# EAGLE design Single Board 12s (EAGLE 9.6.2)
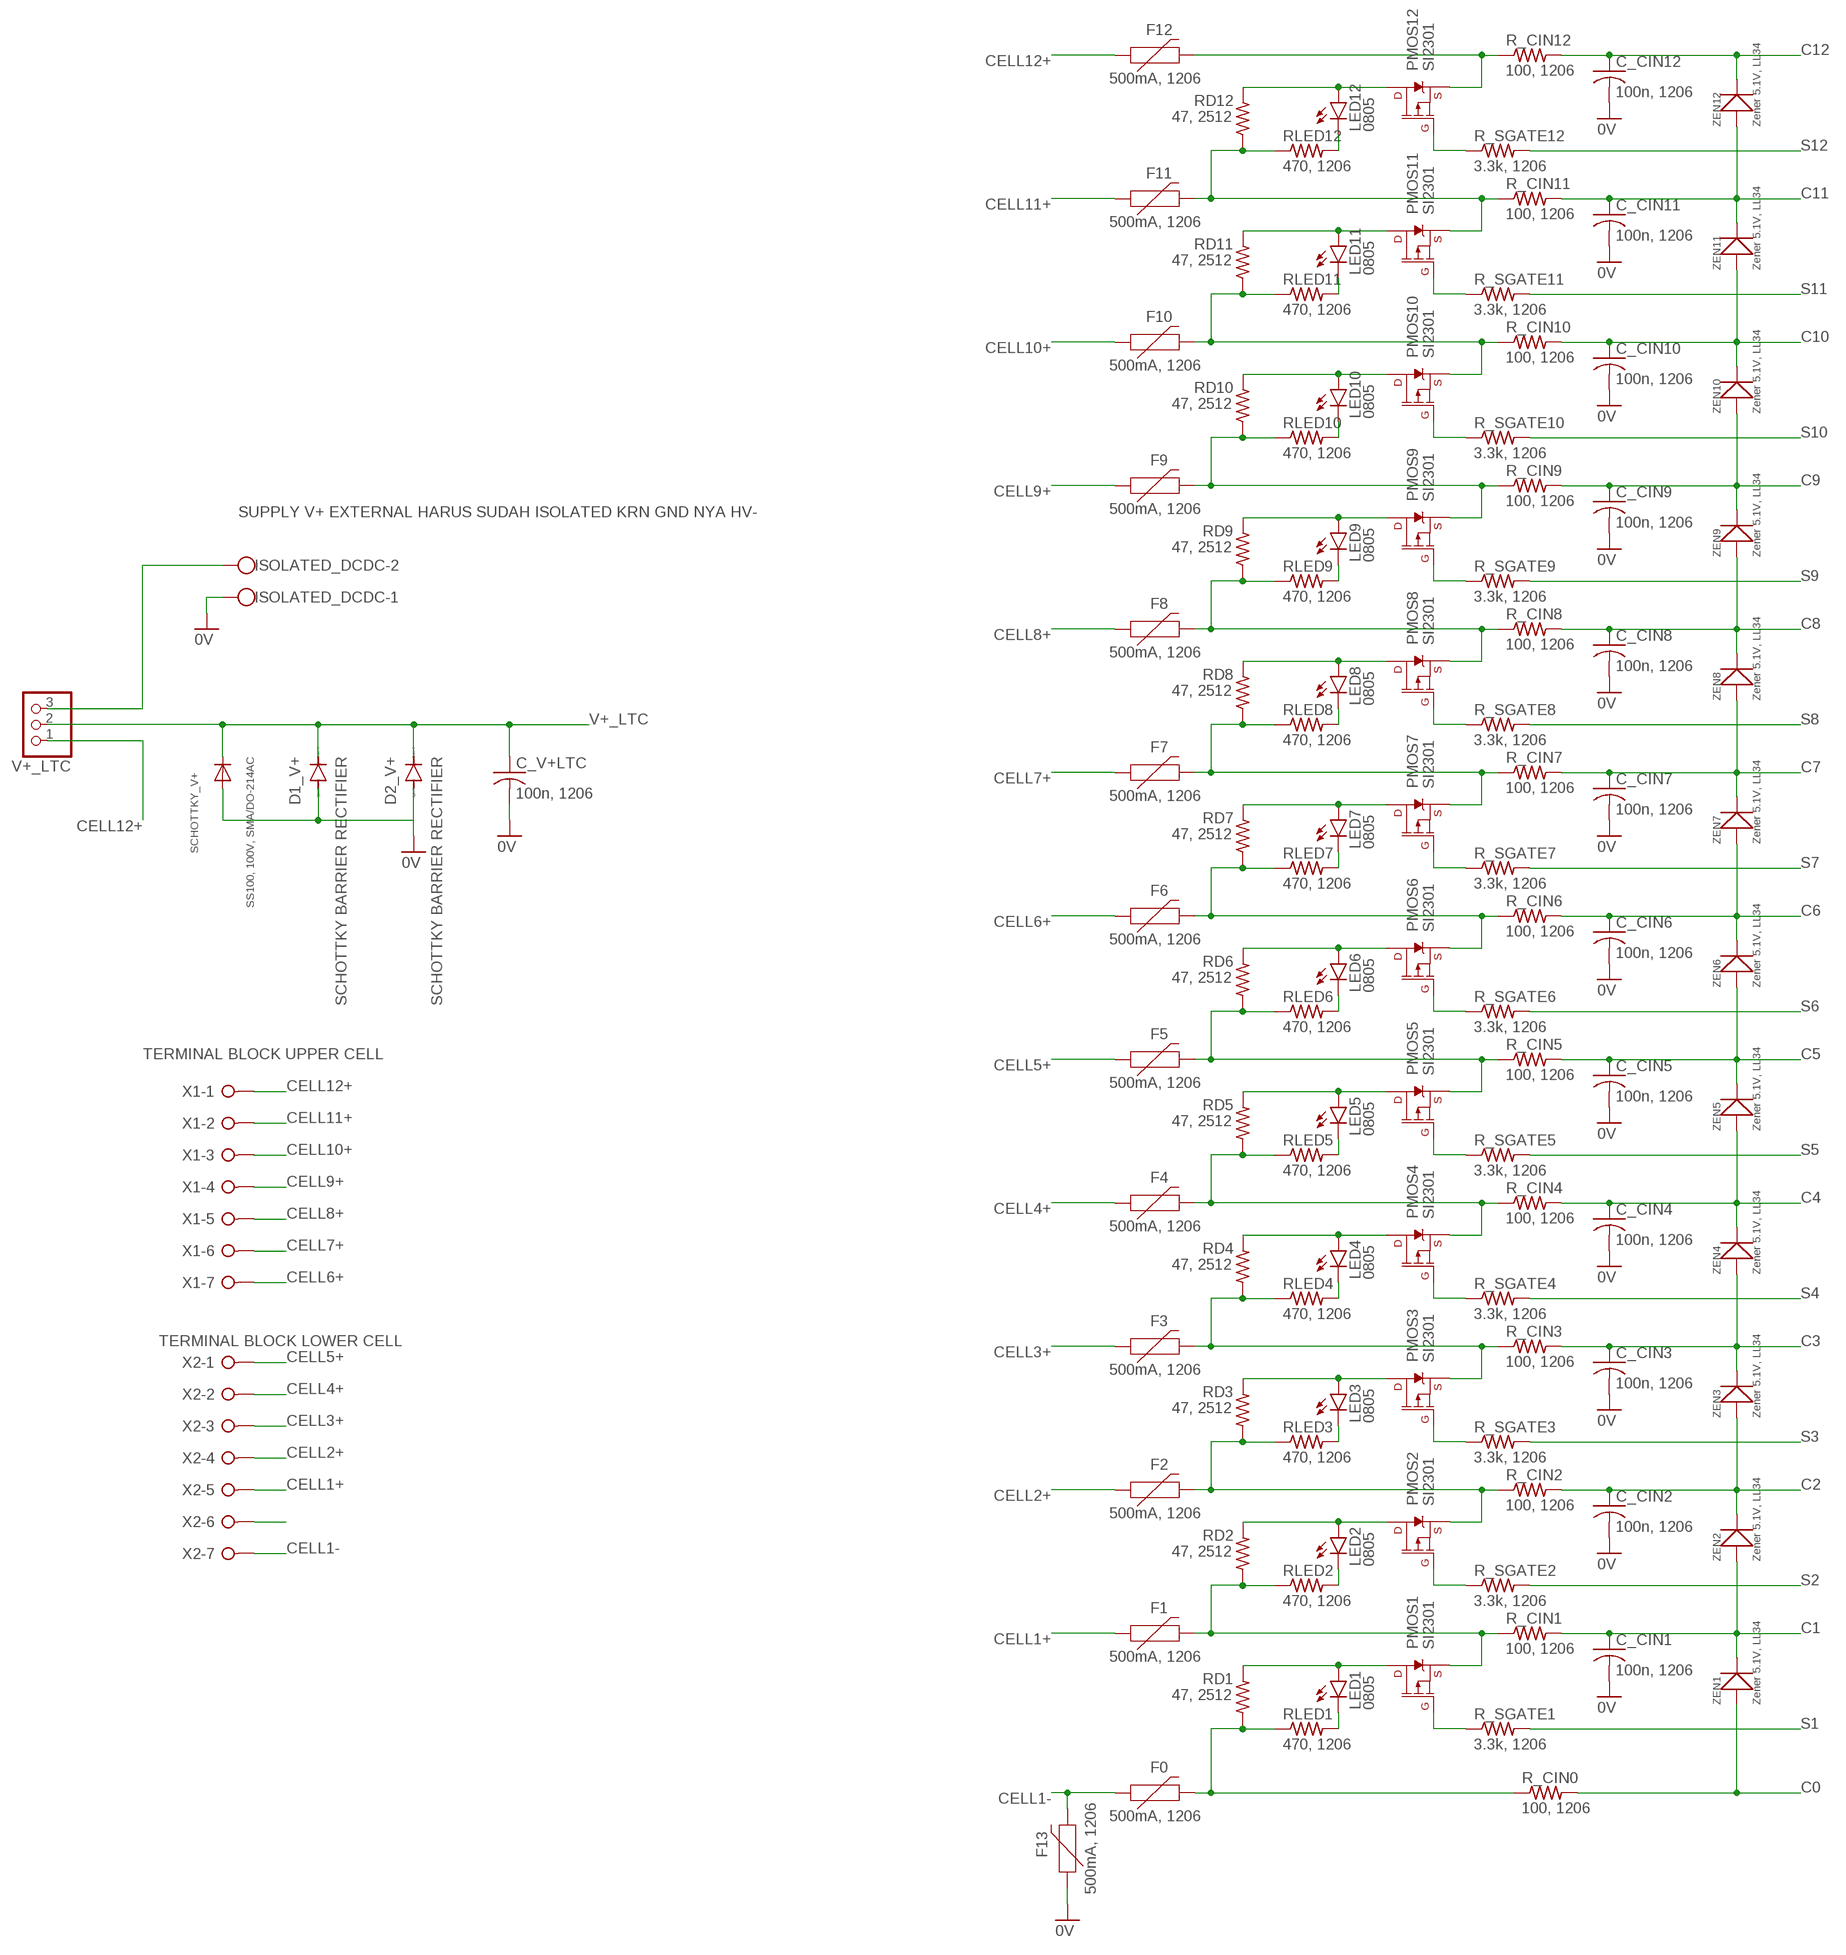
[diagram p0: schematic, sheet 1, part 1 of 2]
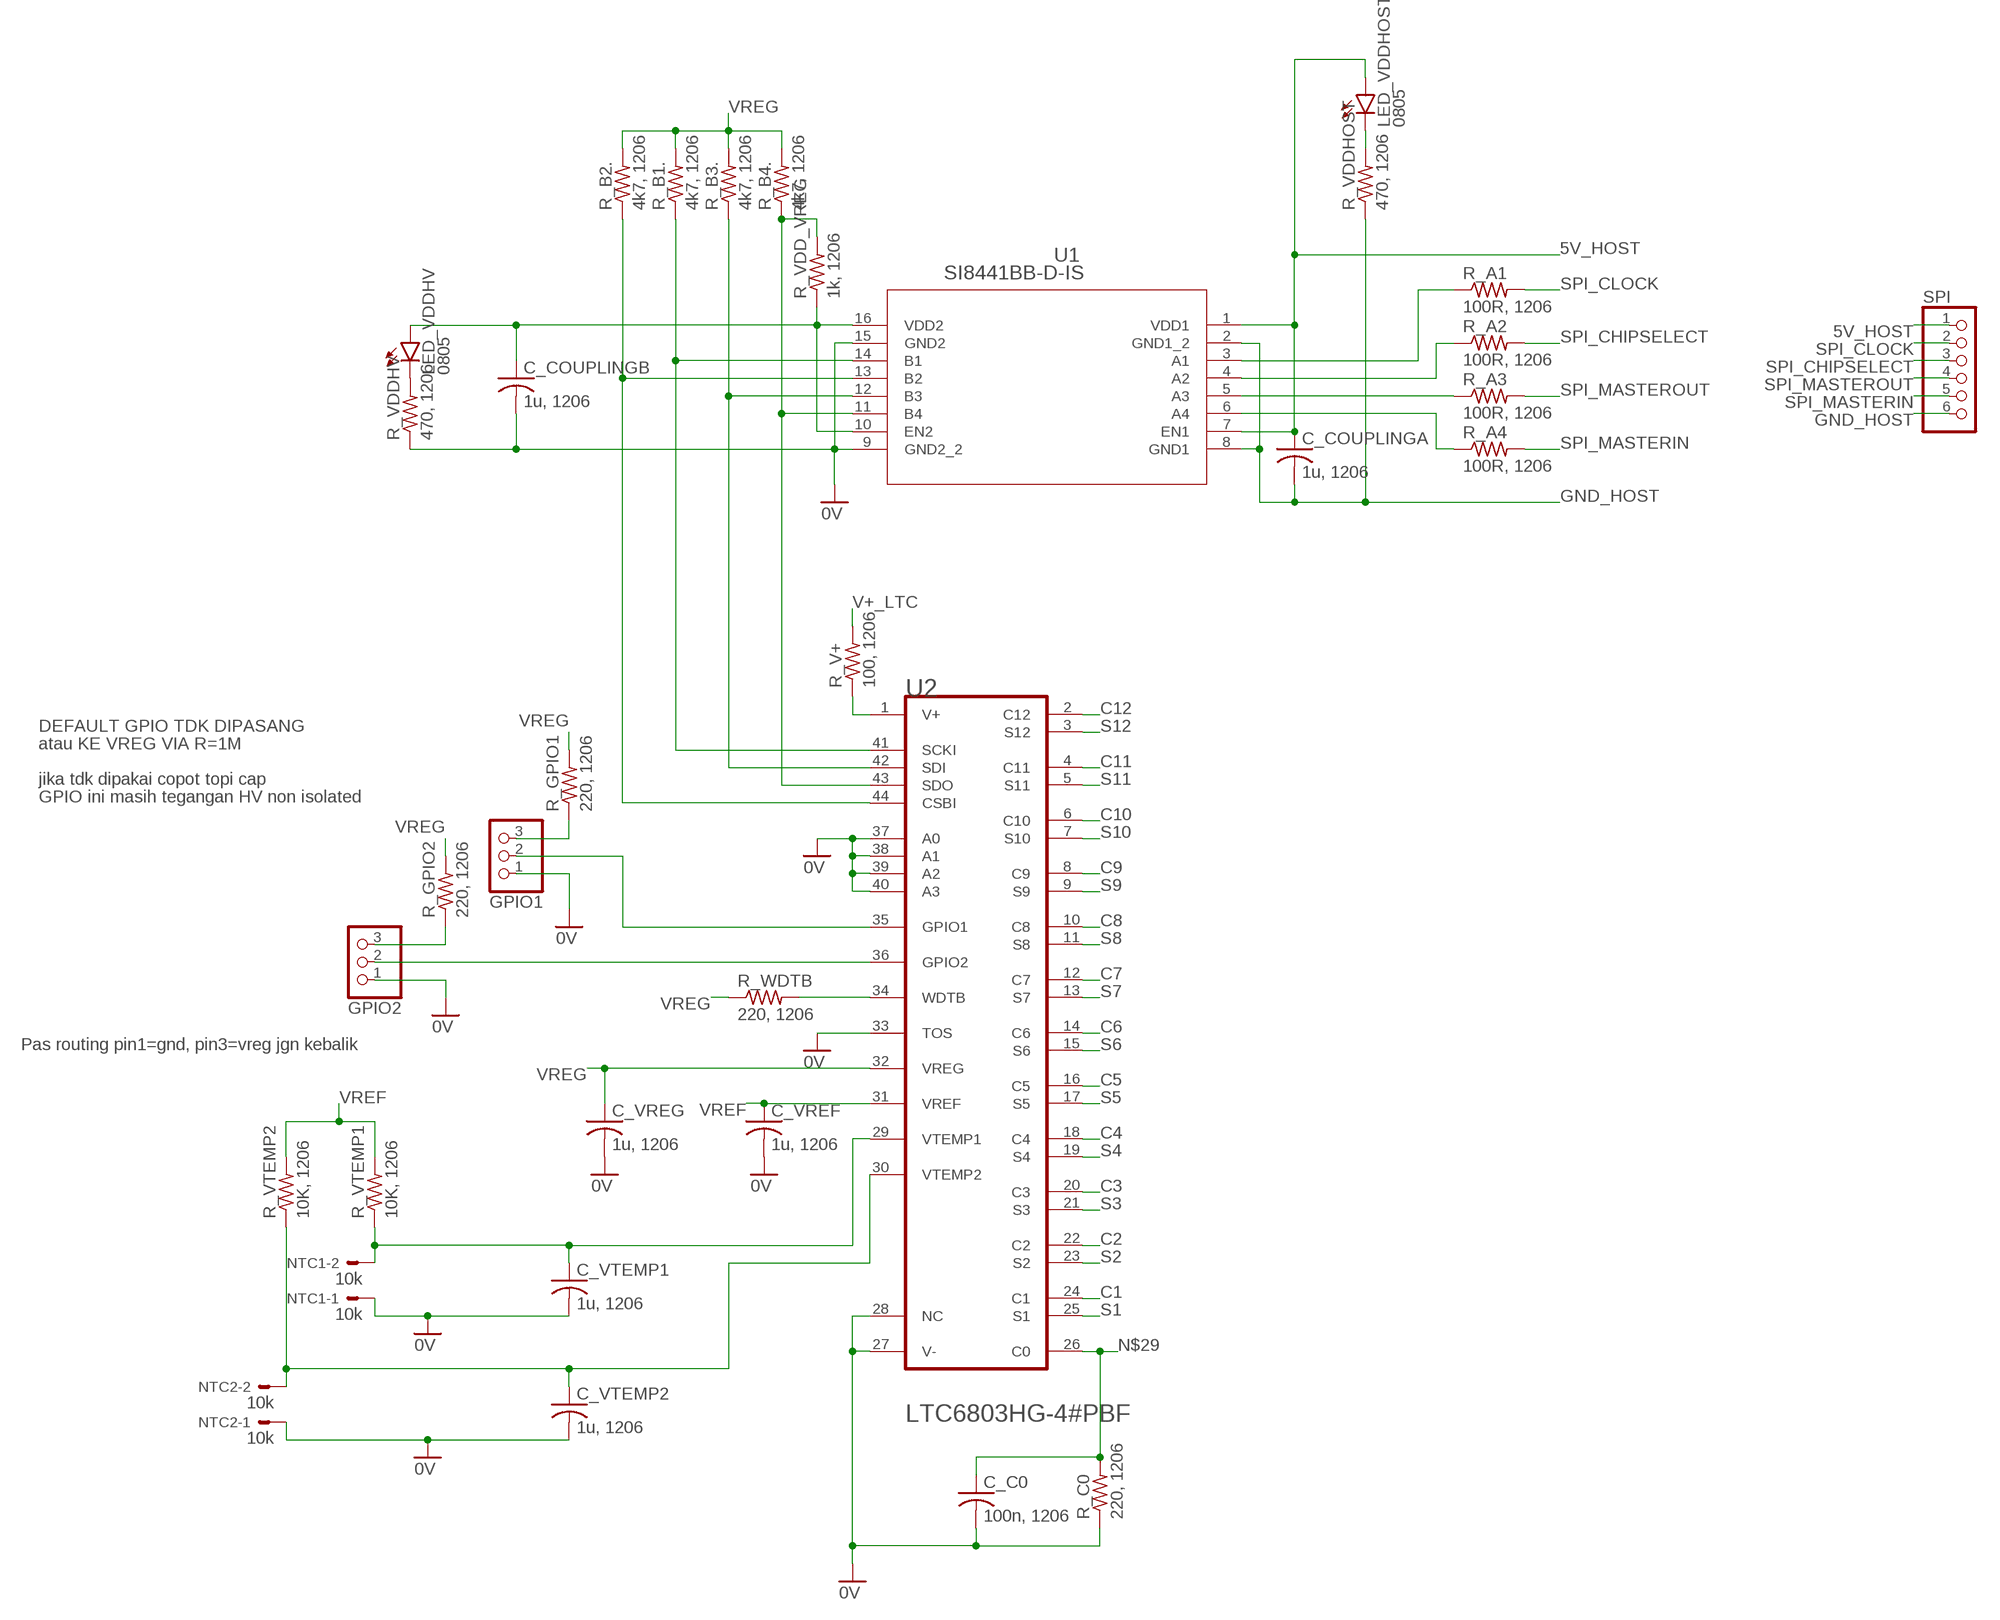
[diagram p1: schematic, sheet 1, part 2 of 2]

## Parts
C_C0  100n, 1206  C-USC1206  [C1206]
C_CIN1  100n, 1206  C-USC1206  [C1206]
C_CIN2  100n, 1206  C-USC1206  [C1206]
C_CIN3  100n, 1206  C-USC1206  [C1206]
C_CIN4  100n, 1206  C-USC1206  [C1206]
C_CIN5  100n, 1206  C-USC1206  [C1206]
C_CIN6  100n, 1206  C-USC1206  [C1206]
C_CIN7  100n, 1206  C-USC1206  [C1206]
C_CIN8  100n, 1206  C-USC1206  [C1206]
C_CIN9  100n, 1206  C-USC1206  [C1206]
C_CIN10  100n, 1206  C-USC1206  [C1206]
C_CIN11  100n, 1206  C-USC1206  [C1206]
C_CIN12  100n, 1206  C-USC1206  [C1206]
C_COUPLINGA  1u, 1206  C-USC1206  [C1206]
C_COUPLINGB  1u, 1206  C-USC1206  [C1206]
C_V+LTC  100n, 1206  C-USC1206  [C1206]
C_VREF  1u, 1206  C-USC1206  [C1206]
C_VREG  1u, 1206  C-USC1206  [C1206]
C_VTEMP1  1u, 1206  C-USC1206  [C1206]
C_VTEMP2  1u, 1206  C-USC1206  [C1206]
D1_V+  SCHOTTKY BARRIER RECTIFIER  DIODE-DO27-15  [DO27-15]
D2_V+  SCHOTTKY BARRIER RECTIFIER  DIODE-DO27-15  [DO27-15]
F0  500mA, 1206  PPTC_6V500MA-2  [1206]
F1  500mA, 1206  PPTC_6V500MA-2  [1206]
F2  500mA, 1206  PPTC_6V500MA-2  [1206]
F3  500mA, 1206  PPTC_6V500MA-2  [1206]
F4  500mA, 1206  PPTC_6V500MA-2  [1206]
F5  500mA, 1206  PPTC_6V500MA-2  [1206]
F6  500mA, 1206  PPTC_6V500MA-2  [1206]
F7  500mA, 1206  PPTC_6V500MA-2  [1206]
F8  500mA, 1206  PPTC_6V500MA-2  [1206]
F9  500mA, 1206  PPTC_6V500MA-2  [1206]
F10  500mA, 1206  PPTC_6V500MA-2  [1206]
F11  500mA, 1206  PPTC_6V500MA-2  [1206]
F12  500mA, 1206  PPTC_6V500MA-2  [1206]
F13  500mA, 1206  PPTC_6V500MA-2  [1206]
GPIO1  PINHD-1X3  [1X03]
GPIO2  PINHD-1X3  [1X03]
ISOLATED_DCDC  W237-102  [W237-102]
LED1  0805  LEDSML0805  [SML0805]
LED2  0805  LEDSML0805  [SML0805]
LED3  0805  LEDSML0805  [SML0805]
LED4  0805  LEDSML0805  [SML0805]
LED5  0805  LEDSML0805  [SML0805]
LED6  0805  LEDSML0805  [SML0805]
LED7  0805  LEDSML0805  [SML0805]
LED8  0805  LEDSML0805  [SML0805]
LED9  0805  LEDSML0805  [SML0805]
LED10  0805  LEDSML0805  [SML0805]
LED11  0805  LEDSML0805  [SML0805]
LED12  0805  LEDSML0805  [SML0805]
LED_VDDHOST  0805  LEDSML0805  [SML0805]
LED_VDDHV  0805  LEDSML0805  [SML0805]
NTC1  10k  KK-156-2  [KK-156-2]
NTC2  10k  KK-156-2  [KK-156-2]
PMOS1  SI2301  MOSFET_PCH-SI2309DS  [SOT23-3]
PMOS2  SI2301  MOSFET_PCH-SI2309DS  [SOT23-3]
PMOS3  SI2301  MOSFET_PCH-SI2309DS  [SOT23-3]
PMOS4  SI2301  MOSFET_PCH-SI2309DS  [SOT23-3]
PMOS5  SI2301  MOSFET_PCH-SI2309DS  [SOT23-3]
PMOS6  SI2301  MOSFET_PCH-SI2309DS  [SOT23-3]
PMOS7  SI2301  MOSFET_PCH-SI2309DS  [SOT23-3]
PMOS8  SI2301  MOSFET_PCH-SI2309DS  [SOT23-3]
PMOS9  SI2301  MOSFET_PCH-SI2309DS  [SOT23-3]
PMOS10  SI2301  MOSFET_PCH-SI2309DS  [SOT23-3]
PMOS11  SI2301  MOSFET_PCH-SI2309DS  [SOT23-3]
PMOS12  SI2301  MOSFET_PCH-SI2309DS  [SOT23-3]
R_A1  100R, 1206  R-US_R1206  [R1206]
R_A2  100R, 1206  R-US_R1206  [R1206]
R_A3  100R, 1206  R-US_R1206  [R1206]
R_A4  100R, 1206  R-US_R1206  [R1206]
R_B1.  4k7, 1206  R-US_R1206  [R1206]
R_B2.  4k7, 1206  R-US_R1206  [R1206]
R_B3.  4k7, 1206  R-US_R1206  [R1206]
R_B4.  4k7, 1206  R-US_R1206  [R1206]
R_C0  220, 1206  R-US_R1206  [R1206]
R_CIN0  100, 1206  R-US_R1206  [R1206]
R_CIN1  100, 1206  R-US_R1206  [R1206]
R_CIN2  100, 1206  R-US_R1206  [R1206]
R_CIN3  100, 1206  R-US_R1206  [R1206]
R_CIN4  100, 1206  R-US_R1206  [R1206]
R_CIN5  100, 1206  R-US_R1206  [R1206]
R_CIN6  100, 1206  R-US_R1206  [R1206]
R_CIN7  100, 1206  R-US_R1206  [R1206]
R_CIN8  100, 1206  R-US_R1206  [R1206]
R_CIN9  100, 1206  R-US_R1206  [R1206]
R_CIN10  100, 1206  R-US_R1206  [R1206]
R_CIN11  100, 1206  R-US_R1206  [R1206]
R_CIN12  100, 1206  R-US_R1206  [R1206]
R_GPIO1  220, 1206  R-US_R1206  [R1206]
R_GPIO2  220, 1206  R-US_R1206  [R1206]
R_SGATE1  3.3k, 1206  R-US_R1206  [R1206]
R_SGATE2  3.3k, 1206  R-US_R1206  [R1206]
R_SGATE3  3.3k, 1206  R-US_R1206  [R1206]
R_SGATE4  3.3k, 1206  R-US_R1206  [R1206]
R_SGATE5  3.3k, 1206  R-US_R1206  [R1206]
R_SGATE6  3.3k, 1206  R-US_R1206  [R1206]
R_SGATE7  3.3k, 1206  R-US_R1206  [R1206]
R_SGATE8  3.3k, 1206  R-US_R1206  [R1206]
R_SGATE9  3.3k, 1206  R-US_R1206  [R1206]
R_SGATE10  3.3k, 1206  R-US_R1206  [R1206]
R_SGATE11  3.3k, 1206  R-US_R1206  [R1206]
R_SGATE12  3.3k, 1206  R-US_R1206  [R1206]
R_V+  100, 1206  R-US_R1206  [R1206]
R_VDD_VREG  1k, 1206  R-US_R1206  [R1206]
R_VDDHOST  470, 1206  R-US_R1206  [R1206]
R_VDDHV  470, 1206  R-US_R1206  [R1206]
R_VTEMP1  10K, 1206  R-US_R1206  [R1206]
R_VTEMP2  10K, 1206  R-US_R1206  [R1206]
R_WDTB  220, 1206  R-US_R1206  [R1206]
RD1  47, 2512  R-US_R2512  [R2512]
RD2  47, 2512  R-US_R2512  [R2512]
RD3  47, 2512  R-US_R2512  [R2512]
RD4  47, 2512  R-US_R2512  [R2512]
RD5  47, 2512  R-US_R2512  [R2512]
RD6  47, 2512  R-US_R2512  [R2512]
RD7  47, 2512  R-US_R2512  [R2512]
RD8  47, 2512  R-US_R2512  [R2512]
RD9  47, 2512  R-US_R2512  [R2512]
RD10  47, 2512  R-US_R2512  [R2512]
RD11  47, 2512  R-US_R2512  [R2512]
RD12  47, 2512  R-US_R2512  [R2512]
RLED1  470, 1206  R-US_R1206  [R1206]
RLED2  470, 1206  R-US_R1206  [R1206]
RLED3  470, 1206  R-US_R1206  [R1206]
RLED4  470, 1206  R-US_R1206  [R1206]
RLED5  470, 1206  R-US_R1206  [R1206]
RLED6  470, 1206  R-US_R1206  [R1206]
RLED7  470, 1206  R-US_R1206  [R1206]
RLED8  470, 1206  R-US_R1206  [R1206]
RLED9  470, 1206  R-US_R1206  [R1206]
RLED10  470, 1206  R-US_R1206  [R1206]
RLED11  470, 1206  R-US_R1206  [R1206]
RLED12  470, 1206  R-US_R1206  [R1206]
SCHOTTKY_V+  SS100, 100V, SMA/DO-214AC  DIODESMA  [SMADIODE]
SPI  PINHD-1X6  [1X06]
U1  SI8441BB-D-IS  [SOIC-16W_SIL]
U2  LINEAR_TECHNOLOGY_LTC6803HG-4#PBFLINEAR_TECHNOLOGY_LTC6803HG-4#PBF_0_2  [LINEAR_TECHNOLOGY_LTC6803HG-4#PBF_2]
V+_LTC  PINHD-1X3  [1X03]
X1  W237-07P  [W237-7P]
X2  W237-07P  [W237-7P]
ZEN1  Zener 5.1V, LL34  SMD-DIODE-SWITCHING-75V-200MA(LL-34)  [LL-34]
ZEN2  Zener 5.1V, LL34  SMD-DIODE-SWITCHING-75V-200MA(LL-34)  [LL-34]
ZEN3  Zener 5.1V, LL34  SMD-DIODE-SWITCHING-75V-200MA(LL-34)  [LL-34]
ZEN4  Zener 5.1V, LL34  SMD-DIODE-SWITCHING-75V-200MA(LL-34)  [LL-34]
ZEN5  Zener 5.1V, LL34  SMD-DIODE-SWITCHING-75V-200MA(LL-34)  [LL-34]
ZEN6  Zener 5.1V, LL34  SMD-DIODE-SWITCHING-75V-200MA(LL-34)  [LL-34]
ZEN7  Zener 5.1V, LL34  SMD-DIODE-SWITCHING-75V-200MA(LL-34)  [LL-34]
ZEN8  Zener 5.1V, LL34  SMD-DIODE-SWITCHING-75V-200MA(LL-34)  [LL-34]
ZEN9  Zener 5.1V, LL34  SMD-DIODE-SWITCHING-75V-200MA(LL-34)  [LL-34]
ZEN10  Zener 5.1V, LL34  SMD-DIODE-SWITCHING-75V-200MA(LL-34)  [LL-34]
ZEN11  Zener 5.1V, LL34  SMD-DIODE-SWITCHING-75V-200MA(LL-34)  [LL-34]
ZEN12  Zener 5.1V, LL34  SMD-DIODE-SWITCHING-75V-200MA(LL-34)  [LL-34]

## Nets
0V: C_C0.2 C_CIN1.2 C_CIN2.2 C_CIN3.2 C_CIN4.2 C_CIN5.2 C_CIN6.2 C_CIN7.2 C_CIN8.2 C_CIN9.2 C_CIN10.2 C_CIN11.2 C_CIN12.2 C_COUPLINGB.2 C_V+LTC.2 C_VREF.2 C_VREG.2 C_VTEMP1.2 C_VTEMP2.2 D1_V+.A D2_V+.A F13.1 GPIO1.1 GPIO2.1 ISOLATED_DCDC.1 NTC1.1 NTC2.1 R_C0.1 R_VDDHV.1 SCHOTTKY_V+.A U1.9(GND2_2) U1.15(GND2) U2.27(V-) U2.28(NC) U2.33(TOS) U2.37(A0) U2.38(A1) U2.39(A2) U2.40(A3)
5V_HOST: C_COUPLINGA.1 LED_VDDHOST.A SPI.1 U1.1(VDD1) U1.7(EN1)
C0: R_CIN0.2 ZEN1.A(+)
C1: C_CIN1.1 R_CIN1.2 U2.24(C1) ZEN1.C(-) ZEN2.A(+)
C2: C_CIN2.1 R_CIN2.2 U2.22(C2) ZEN2.C(-) ZEN3.A(+)
C3: C_CIN3.1 R_CIN3.2 U2.20(C3) ZEN3.C(-) ZEN4.A(+)
C4: C_CIN4.1 R_CIN4.2 U2.18(C4) ZEN4.C(-) ZEN5.A(+)
C5: C_CIN5.1 R_CIN5.2 U2.16(C5) ZEN5.C(-) ZEN6.A(+)
C6: C_CIN6.1 R_CIN6.2 U2.14(C6) ZEN6.C(-) ZEN7.A(+)
C7: C_CIN7.1 R_CIN7.2 U2.12(C7) ZEN7.C(-) ZEN8.A(+)
C8: C_CIN8.1 R_CIN8.2 U2.10(C8) ZEN8.C(-) ZEN9.A(+)
C9: C_CIN9.1 R_CIN9.2 U2.8(C9) ZEN9.C(-) ZEN10.A(+)
C10: C_CIN10.1 R_CIN10.2 U2.6(C10) ZEN10.C(-) ZEN11.A(+)
C11: C_CIN11.1 R_CIN11.2 U2.4(C11) ZEN11.C(-) ZEN12.A(+)
C12: C_CIN12.1 R_CIN12.2 U2.2(C12) ZEN12.C(-)
CELL1+: F1.1 X2.5
CELL1-: F0.1 F13.2 X2.7
CELL2+: F2.1 X2.4
CELL3+: F3.1 X2.3
CELL4+: F4.1 X2.2
CELL5+: F5.1 X2.1
CELL6+: F6.1 X1.7
CELL7+: F7.1 X1.6
CELL8+: F8.1 X1.5
CELL9+: F9.1 X1.4
CELL10+: F10.1 X1.3
CELL11+: F11.1 X1.2
CELL12+: F12.1 V+_LTC.1 X1.1
GND_HOST: C_COUPLINGA.2 R_VDDHOST.1 SPI.6 U1.2(GND1_2) U1.8(GND1)
N$1: R_V+.1 U2.1(V+)
N$2: PMOS1.1(G) R_SGATE1.1
N$3: LED1.A PMOS1.3(D) RD1.2
N$4: R_A2.1 U1.4(A2)
N$5: LED_VDDHOST.C R_VDDHOST.2
N$6: LED1.C RLED1.2
N$7: F0.2 R_CIN0.1 RD1.1 RLED1.1
N$8: R_WDTB.2 U2.34(WDTB)
N$9: ISOLATED_DCDC.2 V+_LTC.3
N$10: LED_VDDHV.C R_VDDHV.2
N$12: PMOS2.1(G) R_SGATE2.1
N$15: R_B4..1 R_VDD_VREG.2 U1.11(B4) U2.43(SDO)
N$16: LED2.A PMOS2.3(D) RD2.2
N$17: LED2.C RLED2.2
N$18: F1.2 PMOS1.2(S) R_CIN1.1 RD2.1 RLED2.1
N$19: R_B3..1 U1.12(B3) U2.42(SDI)
N$20: R_B2..1 U1.13(B2) U2.44(CSBI)
N$21: PMOS3.1(G) R_SGATE3.1
N$22: R_B1..1 U1.14(B1) U2.41(SCKI)
N$23: R_A3.1 U1.5(A3)
N$24: R_A1.1 U1.3(A1)
N$25: LED3.A PMOS3.3(D) RD3.2
N$26: LED3.C RLED3.2
N$27: F2.2 PMOS2.2(S) R_CIN2.1 RD3.1 RLED3.1
N$28: R_A4.1 U1.6(A4)
N$29: C_C0.1 R_C0.2 U2.26(C0)
N$30: PMOS4.1(G) R_SGATE4.1
N$31: GPIO2.2 U2.36(GPIO2)
N$32: GPIO1.2 U2.35(GPIO1)
N$33: C_VTEMP2.1 NTC2.2 R_VTEMP2.1 U2.30(VTEMP2)
N$34: LED4.A PMOS4.3(D) RD4.2
N$35: LED4.C RLED4.2
N$36: F3.2 PMOS3.2(S) R_CIN3.1 RD4.1 RLED4.1
N$37: C_VTEMP1.1 NTC1.2 R_VTEMP1.1 U2.29(VTEMP1)
N$38: GPIO2.3 R_GPIO2.1
N$39: PMOS5.1(G) R_SGATE5.1
N$40: GPIO1.3 R_GPIO1.1
N$43: LED5.A PMOS5.3(D) RD5.2
N$44: LED5.C RLED5.2
N$45: F4.2 PMOS4.2(S) R_CIN4.1 RD5.1 RLED5.1
N$48: PMOS6.1(G) R_SGATE6.1
N$51: X2.6
N$52: LED6.A PMOS6.3(D) RD6.2
N$53: LED6.C RLED6.2
N$54: F5.2 PMOS5.2(S) R_CIN5.1 RD6.1 RLED6.1
N$57: PMOS7.1(G) R_SGATE7.1
N$61: LED7.A PMOS7.3(D) RD7.2
N$62: LED7.C RLED7.2
N$63: F6.2 PMOS6.2(S) R_CIN6.1 RD7.1 RLED7.1
N$66: PMOS8.1(G) R_SGATE8.1
N$70: LED8.A PMOS8.3(D) RD8.2
N$71: LED8.C RLED8.2
N$72: F7.2 PMOS7.2(S) R_CIN7.1 RD8.1 RLED8.1
N$75: PMOS9.1(G) R_SGATE9.1
N$79: LED9.A PMOS9.3(D) RD9.2
N$80: LED9.C RLED9.2
N$81: F8.2 PMOS8.2(S) R_CIN8.1 RD9.1 RLED9.1
N$84: PMOS10.1(G) R_SGATE10.1
N$88: LED10.A PMOS10.3(D) RD10.2
N$89: LED10.C RLED10.2
N$90: F9.2 PMOS9.2(S) R_CIN9.1 RD10.1 RLED10.1
N$93: PMOS11.1(G) R_SGATE11.1
N$97: LED11.A PMOS11.3(D) RD11.2
N$98: LED11.C RLED11.2
N$99: F10.2 PMOS10.2(S) R_CIN10.1 RD11.1 RLED11.1
N$102: PMOS12.1(G) R_SGATE12.1
N$105: F12.2 PMOS12.2(S) R_CIN12.1
N$106: LED12.A PMOS12.3(D) RD12.2
N$107: LED12.C RLED12.2
N$108: F11.2 PMOS11.2(S) R_CIN11.1 RD12.1 RLED12.1
S1: R_SGATE1.2 U2.25(S1)
S2: R_SGATE2.2 U2.23(S2)
S3: R_SGATE3.2 U2.21(S3)
S4: R_SGATE4.2 U2.19(S4)
S5: R_SGATE5.2 U2.17(S5)
S6: R_SGATE6.2 U2.15(S6)
S7: R_SGATE7.2 U2.13(S7)
S8: R_SGATE8.2 U2.11(S8)
S9: R_SGATE9.2 U2.9(S9)
S10: R_SGATE10.2 U2.7(S10)
S11: R_SGATE11.2 U2.5(S11)
S12: R_SGATE12.2 U2.3(S12)
SPI_CHIPSELECT: R_A2.2 SPI.3
SPI_CLOCK: R_A1.2 SPI.2
SPI_MASTERIN: R_A4.2 SPI.5
SPI_MASTEROUT: R_A3.2 SPI.4
V+_LTC: C_V+LTC.1 D1_V+.C D2_V+.C R_V+.2 SCHOTTKY_V+.C V+_LTC.2
VREF: C_VREF.1 R_VTEMP1.2 R_VTEMP2.2 U2.31(VREF)
VREG: C_COUPLINGB.1 C_VREG.1 LED_VDDHV.A R_B1..2 R_B2..2 R_B3..2 R_B4..2 R_GPIO1.2 R_GPIO2.2 R_VDD_VREG.1 R_WDTB.1 U1.10(EN2) U1.16(VDD2) U2.32(VREG)

## Notes on the sheet
- SUPPLY V+ EXTERNAL HARUS SUDAH ISOLATED KRN GND NYA HV-
- DEFAULT GPIO TDK DIPASANG
- atau KE VREG VIA R=1M
- jika tdk dipakai copot topi cap
- TERMINAL BLOCK UPPER CELL | GPIO ini masih tegangan HV non isolated
- Pas routing pin1=gnd, pin3=vreg jgn kebalik
- TERMINAL BLOCK LOWER CELL

## Library data of the parts
C_C0 C_CIN1-C_CIN12 C_COUPLINGA C_COUPLINGB C_V+LTC C_VREF C_VREG C_VTEMP1 C_VTEMP2 = rcl:C-US: CAPACITOR, American symbol; SPICEPREFIX: C
D1_V+ D2_V+ = diode:DIODE-: DIODE
F0 F1-F13 = SparkFun-Fuses:PPTC: Resettable Fuse PPTC Resettable Fuse. Really a sort of resistor with a polymeric positive temperature coefficient whose resistance increases dramatically with an increase in temperature. When heated by the power passing through the resistance rises causing the current to be limited, protecting the circuit. This is achieved by the transition of the polymer from a crystalline to an amorphous state where the conductive carbon separates breaking the conductive pathways found in the cool crystalline structure. When a PPTC cools back down it resumes conducting letting the circuit turn back on. SparkFun Products: SparkFun RedBoard - Programmed with Arduino <https://www.sparkfun.com/products/12757> Pro Micro - 5V/16MHz <https://www.sparkfun.com/products/12640> Arduino Pro 328 - 5V/16MHz <https://www.sparkfun.com/products/10915> MP3 Trigger <https://www.sparkfun.com/products/13720>; PROD_ID: RES-08585; VALUE: 6V/0.5A
GPIO1 GPIO2 V+_LTC = pinhead:PINHD-1X3: PIN HEADER
ISOLATED_DCDC = con-wago-500:W237-102: WAGO SCREW CLAMP; MPN: 237-102; OC_FARNELL: unknown; OC_NEWARK: 70K9898
LED1-LED12 LED_VDDHOST LED_VDDHV = led:LED: LED OSRAM: - CHIPLED LG R971, LG N971, LY N971, LG Q971, LY Q971, LO R971, LY R971 LH N974, LH R974 LS Q976, LO Q976, LY Q976 LO Q996 - Hyper CHIPLED LW Q18S LB Q993, LB Q99A, LB R99A - SideLED LS A670, LO A670, LY A670, LG A670, LP A670 LB A673, LV A673, LT A673, LW A673 LH A674 LY A675 LS A676, LA A676, LO A676, LY A676, LW A676 LS A679, LY A679, LG A679 - Hyper Micro SIDELED® LS Y876, LA Y876, LO Y876, LY Y876 LT Y87S - SmartLED LW L88C, LW L88S LB L89C, LB L89S, LG L890 LS L89K, LO L89K, LY L89K LS L896, LA L896, LO L896, LY L896 - TOPLED LS T670, LO T670, LY T670, LG T670, LP T670 LSG T670, LSP T670, LSY T670, LOP T670, LYG T670 LG T671, LOG T671, LSG T671 LB T673, LV T673, LT T673, LW T673 LH T674 LS T676, LA T676, LO T676, LY T676, LB T676, LH T676, LSB T676, LW T676 LB T67C, LV T67C, LT T67C, LS T67K, LO T67K, LY T67K, LW E67C LS E67B, LA E67B, LO E67B, LY E67B, LB E67C, LV E67C, LT E67C LW T67C LS T679, LY T679, LG T679 LS T770, LO T770, LY T770, LG T770, LP T770 LB T773, LV T773, LT T773, LW T773 LH T774 LS E675, LA E675, LY E675, LS T675 LS T776, LA T776, LO T776, LY T776, LB T776 LHGB T686 LT T68C, LB T68C - Hyper Mini TOPLED® LB M676 - Mini TOPLED Santana® LG M470 LS M47K, LO M47K, LY M47K Source: http://www.osram.convergy.de LUXEON: - LUMILED® LXK2-PW12-R00, LXK2-PW12-S00, LXK2-PW14-U00, LXK2-PW14-V00 LXK2-PM12-R00, LXK2-PM12-S00, LXK2-PM14-U00 LXK2-PE12-Q00, LXK2-PE12-R00, LXK2-PE12-S00, LXK2-PE14-T00, LXK2-PE14-U00 LXK2-PB12-K00, LXK2-PB12-L00, LXK2-PB12-M00, LXK2-PB14-N00, LXK2-PB14-P00, LXK2-PB14-Q00 LXK2-PR12-L00, LXK2-PR12-M00, LXK2-PR14-Q00, LXK2-PR14-R00 LXK2-PD12-Q00, LXK2-PD12-R00, LXK2-PD12-S00 LXK2-PH12-R00, LXK2-PH12-S00 LXK2-PL12-P00, LXK2-PL12-Q00, LXK2-PL12-R00 Source: www.luxeon.com KINGBRIGHT: KA-3528ASYC Source: www.kingbright.com
NTC1 NTC2 = con-molex:KK-156-2: KK 156 HEADER Source: http://www.molex.com/pdm_docs/sd/026604100_sd.pdf; MF: MOLEX; OC_FARNELL: unknown; OC_NEWARK: unknown
PMOS1-PMOS12 = SparkFun-DiscreteSemi:MOSFET_PCH: P-channel MOSFETs Voltage controlled devices that allow control of high current outputs. SparkFun Products: SparkFun ESP32 Thing <https://www.sparkfun.com/products/13907> SparkFun ESP8266 Thing <https://www.sparkfun.com/products/13231> SparkFun Pi Servo HAT V2 <https://www.sparkfun.com/products/15316> DMG2305UX-7 (20V/4.2A/SOT23-3); PROD_ID: TRANS-08285; VALUE: 1.1A/60V/600mΩ
R_A1-R_A4 R_B1. R_B2. R_B3. R_B4. R_C0 R_CIN0 R_CIN1-R_CIN12 R_GPIO1 R_GPIO2 R_SGATE1-R_SGATE12 R_V+ R_VDD_VREG R_VDDHOST R_VDDHV R_VTEMP1 R_VTEMP2 R_WDTB RD1-RD12 RLED1-RLED12 = rcl:R-US_: RESISTOR, American symbol; SPICEPREFIX: R
SCHOTTKY_V+ = adafruit:DIODE: Diode SMADIODE - SMA Surface Mount Package 20V 1A Schottky Diode Digikey: 641-1014-6-ND DO-1N4148 - Through Hole Small Current Diode SOD-123 20V 1 A (.5mV Vf) Schottky Diode - Digikey: MBRX120TPMSCT-ND SOD-323 10V 570mA (.38mV Vf, 3ns) Schottky Diode - Digikey: ZLLS410CT-ND SOD-523 30V 30mA Schottky Diode (RB751S-40TE61) - Digikey: RB751S-40TE61CT-ND SOT23-R/W - SOT23 Package (R = Solder Paste/Reflow Ovens, W = Hand-Soldering) BAT54Film 40V 300mA - Digikey: 497-7162-1-ND
SPI = pinhead:PINHD-1X6: PIN HEADER
U1 = SI8441BB:SI8441BB-D-IS; COPYRIGHT: Copyright (C) 2021 Ultra Librarian. All rights reserved.; DIGI-KEY_PART_NUMBER_1: 336-1762-5-ND; MANUFACTURER_PART_NUMBER: SI8441BB-D-IS; MFR_NAME: Silicon Labs
U2 = Linear Technology - LTC6803HG-4#PBF:LINEAR_TECHNOLOGY_LTC6803HG-4#PBF: LT-LTC6803-4-G-44; BATTERY_CHEMISTRY: Li-Ion, Supercapacitors, Multi-Chemistry; CIIVA_IDS: 1416646; COMPONENT_LINK_1_DESCRIPTION: Manufacturer URL; COMPONENT_LINK_1_URL: http://www.linear.com/; COMPONENT_LINK_3_DESCRIPTION: Package Specification; COMPONENT_LINK_3_URL: http://cds.linear.com/docs/en/packaging/SSOP_44_05-08-1754.pdf; DATASHEET: http://cds.linear.com/docs/en/datasheet/680324fa.pdf; DATASHEET_VERSION: Rev. A; FOOTPRINT_VARIANT_NAME_0: Level C; FOOTPRINT_VARIANT_NAME_1: Level B; FOOTPRINT_VARIANT_NAME_2: Level A; IMPORTED: yes; IMPORTED_FROM: vault; IMPORT_TS: 1521854382; MF: Linear Technology; MOUNTING_TECHNOLOGY: Surface Mount; MPN: LTC6803HG-4#PBF; NUMBER_OF_CELLS: > 1000 V of stacked Li-Ion cells; PACKAGE: G-44; PACKAGE_DESCRIPTION: 44-Pin Plastic SSOP, Body 12.8 x 5.3 mm, Pitch 0.5 mm; PACKAGE_VERSION: Rev. Ã ̃, 06/2010; PIN_0_0_40_INSIDE_EDGE: clock; PREFIX: U; RELEASE_DATE: 1377764895; ROHS: Yes; TYPE_OF_CHARGER: Battery Stack Monitor; VAULT_GUID: BA7F31F3-B2E0-4312-B550-1E6C11B00551; VAULT_REVISION: 890CB210-B5D1-4A20-8471-0AD6F7E52161; VIN_MAXV: 60
X1 X2 = con-wago-508:W237-07P: WAGO SREW CLAMP; OC_FARNELL: unknown; OC_NEWARK: unknown
ZEN1-ZEN12 = Zener SMD LL-34:SMD-DIODE-SWITCHING-75V-200MA(LL-34): 304040011; MPN: LL4148ST; VALUE: 75V-200MA

## Board
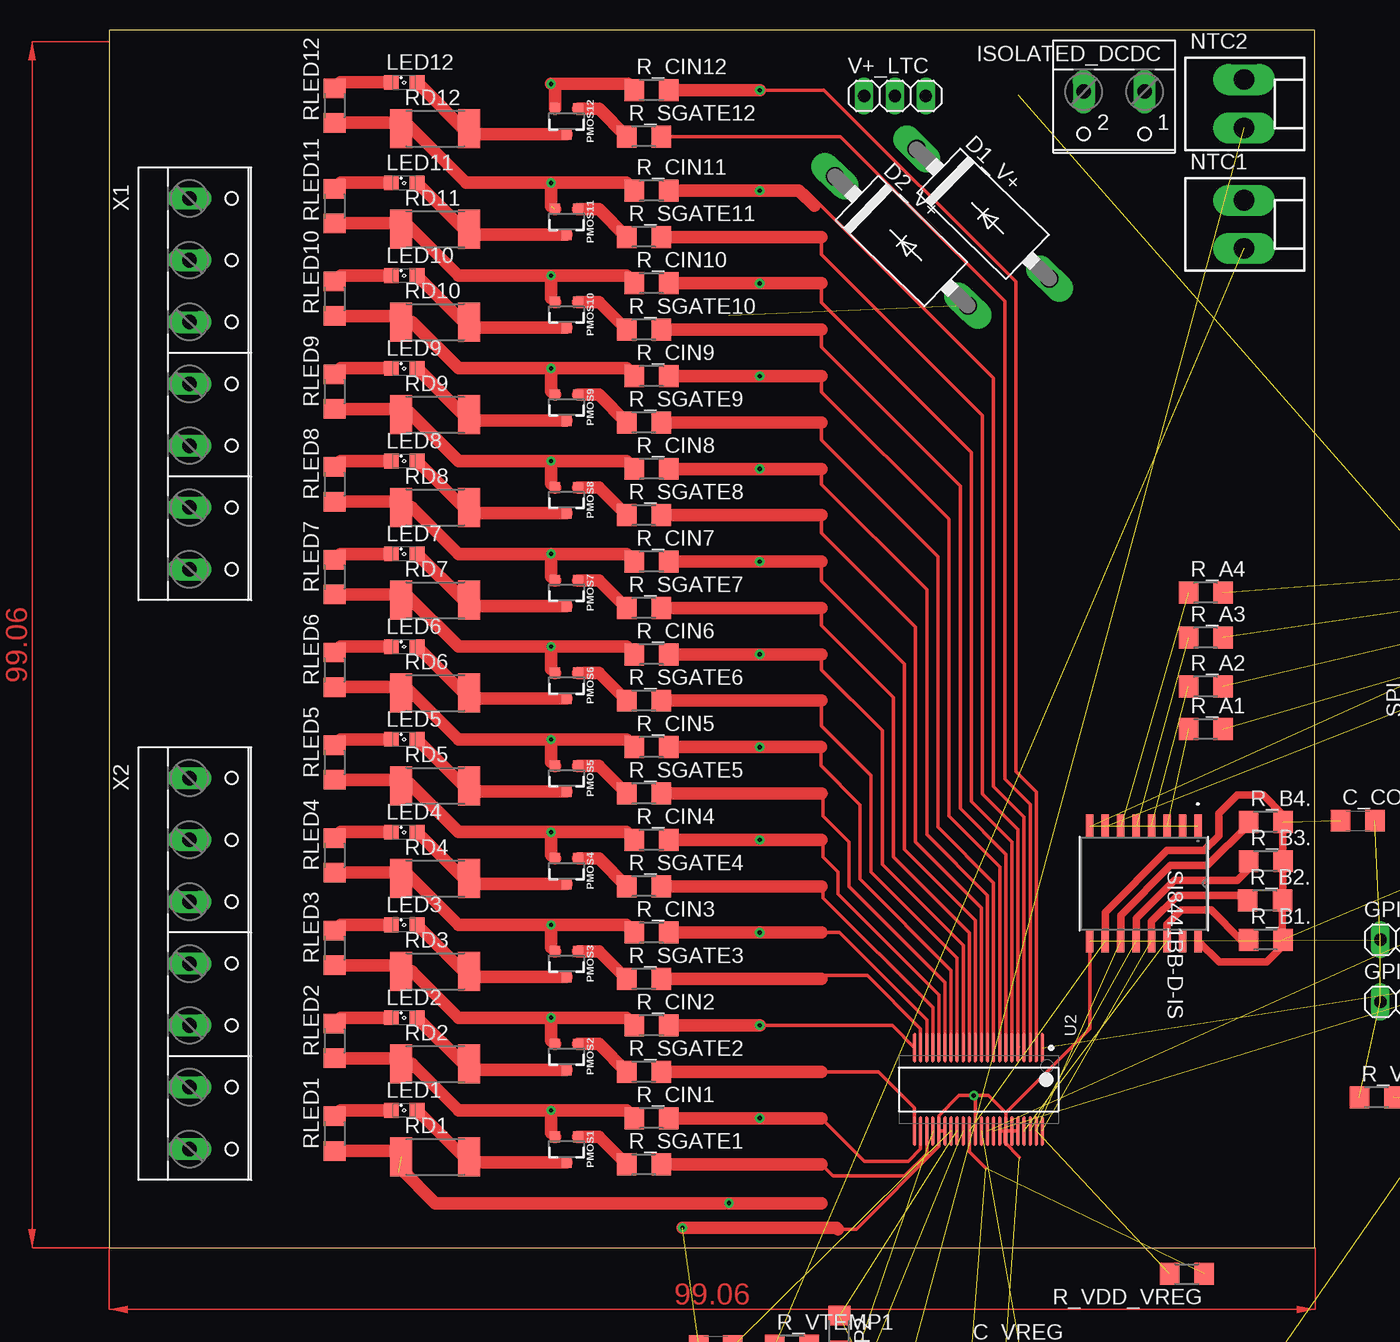
[diagram p2: board, top side]
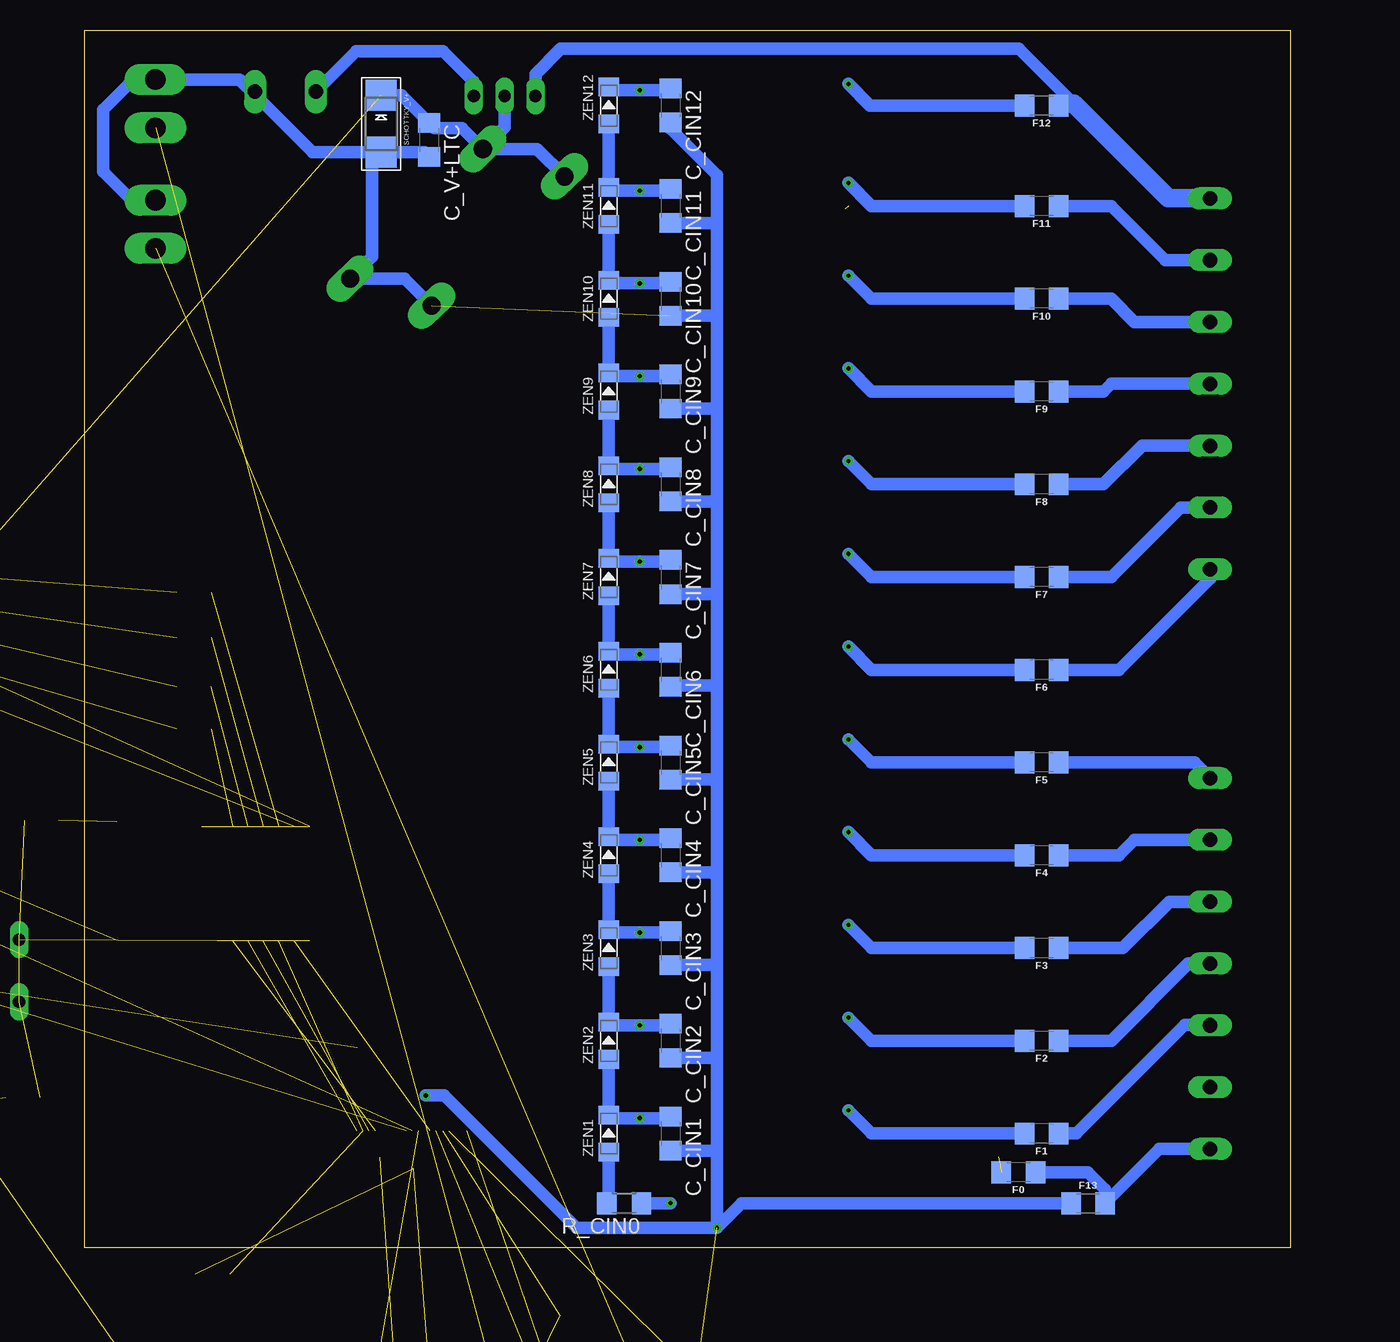
[diagram p3: board, bottom side, seen from below]

Size 99.04 x 100 mm. Coordinates in mm from the lower left corner, seen from the top.
Outline: 0,0 99.04,0 99.04,100 0,100 0,0
Copper layers (1*16): Top 0.035mm / dielectric 1.5mm / Bottom 0.035mm
Design rules "default": minimum track width 6mil, minimum drill 0.35mm, track to track 6mil, track to pad 6mil, pad to pad 6mil, via to via 6mil, smd to smd 6mil, copper to edge 40mil, drill to drill 6mil, minimum pad ring 10mil, minimum via ring 8mil, stop-mask expansion 4mil, vias tented up to drill 0mil, thermal gap 10mil

### Footprints (pad centres in the part's own frame; a part is rotated, then mirrored left to right if it is on the bottom)
C1206 = smd 1.6 x 1.8: 1 -1.4,0; 2 1.4,0
DO27-15 = drill 1.499 long: A 7.62,0; C -7.62,0
1206 = smd 1.6 x 1.8: 1 -1.4,0; 2 1.4,0
1X03 = drill 1.016 long: 1 -2.54,0; 2 0,0; 3 2.54,0
W237-102 = drill 1.194 long: 1 -2.5,-1.27; 2 2.5,-1.27
SML0805 = smd 1.2 x 1.2: A 1.05,0; C -1.05,0
KK-156-2 = drill 1.7 pad 2.184 long: 1 -1.98,0; 2 1.98,0
SOT23-3 = smd 0.8 x 0.9: 1 -0.95,-1; 2 0.95,-1; 3 0,1.1
R1206 = smd 1.6 x 1.803: 1 -1.422,0; 2 1.422,0
R2512 = smd 1.8 x 3.2: 1 -2.8,0; 2 2.8,0
SMADIODE = smd 2.54 x 2.54: A 2.349,0; C -2.349,0
1X06 = drill 1.016 long: 1 -6.35,0; 2 -3.81,0; 3 -1.27,0; 4 1.27,0; 5 3.81,0; 6 6.35,0
SOIC-16W_SIL = smd 1.9 x 0.6: 1 -4.7,4.445; 2 -4.7,3.175; 3 -4.7,1.905; 4 -4.7,0.635; 5 -4.7,-0.635; 6 -4.7,-1.905; 7 -4.7,-3.175; 8 -4.7,-4.445; 9 4.7,-4.445; 10 4.7,-3.175; 11 4.7,-1.905; 12 4.7,-0.635; 13 4.7,0.635; 14 4.7,1.905; 15 4.7,3.175; 16 4.7,4.445
LINEAR_TECHNOLOGY_LTC6803HG-4#PBF_2 = smd 2.45 x 0.25: 1 -3.425,5.25; 2 -3.425,4.75; 3 -3.425,4.25; 4 -3.425,3.75; 5 -3.425,3.25; 6 -3.425,2.75; 7 -3.425,2.25; 8 -3.425,1.75; 9 -3.425,1.25; 10 -3.425,0.75; 11 -3.425,0.25; 12 -3.425,-0.25; 13 -3.425,-0.75; 14 -3.425,-1.25; 15 -3.425,-1.75; 16 -3.425,-2.25; 17 -3.425,-2.75; 18 -3.425,-3.25; 19 -3.425,-3.75; 20 -3.425,-4.25; 21 -3.425,-4.75; 22 -3.425,-5.25; 23 3.425,-5.25; 24 3.425,-4.75; 25 3.425,-4.25; 26 3.425,-3.75; 27 3.425,-3.25; 28 3.425,-2.75; 29 3.425,-2.25; 30 3.425,-1.75; 31 3.425,-1.25; 32 3.425,-0.75; 33 3.425,-0.25; 34 3.425,0.25; 35 3.425,0.75; 36 3.425,1.25; 37 3.425,1.75; 38 3.425,2.25; 39 3.425,2.75; 40 3.425,3.25; 41 3.425,3.75; 42 3.425,4.25; 43 3.425,4.75; 44 3.425,5.25
W237-7P = drill 1.194 long: 1 -15.24,-0.635; 2 -10.16,-0.635; 3 -5.08,-0.635; 4 0,-0.635; 5 5.08,-0.635; 6 10.16,-0.635; 7 15.24,-0.635
LL-34 = smd 1.524 x 1.676: A -1.524,0; C 1.524,0

### Placement (x,y rotation side)
C_C0  50.04,-45.85 0 top  (outside the outline)
C_CIN1  50.9,9.37 270 bottom
C_CIN2  50.9,16.99 270 bottom
C_CIN3  50.9,24.61 270 bottom
C_CIN4  50.9,32.23 270 bottom
C_CIN5  50.9,39.85 270 bottom
C_CIN6  50.9,47.47 270 bottom
C_CIN7  50.9,55.09 270 bottom
C_CIN8  50.9,62.71 270 bottom
C_CIN9  50.9,70.33 270 bottom
C_CIN10  50.9,77.95 270 bottom
C_CIN11  50.9,85.57 270 bottom
C_CIN12  50.9,93.83 270 bottom
C_COUPLINGA  120.12,51.05 90 top  (outside the outline)
C_COUPLINGB  102.57,35.08 0 top
C_V+LTC  70.74,91.01 270 bottom
C_VREF  56.77,-26.54 0 top  (outside the outline)
C_VREG  72.21,-8.86 0 top  (outside the outline)
C_VTEMP1  49.83,-8.1 180 top  (outside the outline)
C_VTEMP2  65.79,-14.61 0 top  (outside the outline)
D1_V+  71.78,84.94 315.7 top
D2_V+  65.07,82.7 315.8 top
F0  22.33,6.2 180 bottom
F1  20.42,9.37 180 bottom
F2  20.42,16.99 180 bottom
F3  20.42,24.61 180 bottom
F4  20.42,32.23 180 bottom
F5  20.42,39.85 180 bottom
F6  20.42,47.47 180 bottom
F7  20.42,55.09 180 bottom
F8  20.42,62.71 180 bottom
F9  20.42,70.33 180 bottom
F10  20.42,77.95 180 bottom
F11  20.42,85.57 180 bottom
F12  20.42,93.83 180 bottom
F13  16.61,3.66 0 bottom
GPIO1  106.96,25.3 0 top  (outside the outline)
GPIO2  106.96,20.19 0 top  (outside the outline)
ISOLATED_DCDC  82.55,93.7 180 top
LED1  24.23,11.28 0 top
LED2  24.23,18.9 0 top
LED3  24.23,26.52 0 top
LED4  24.23,34.14 0 top
LED5  24.23,41.76 0 top
LED6  24.23,49.38 0 top
LED7  24.23,57 0 top
LED8  24.23,64.62 0 top
LED9  24.23,72.24 0 top
LED10  24.23,79.86 0 top
LED11  24.23,87.48 0 top
LED12  24.23,95.73 0 top
LED_VDDHOST  125.15,56.64 0 top  (outside the outline)
LED_VDDHV  109.3,11.96 0 top  (outside the outline)
NTC1  93.22,84.07 270 top
NTC2  93.22,93.98 270 top
PMOS1  37.57,8.1 180 top
PMOS2  37.57,15.72 180 top
PMOS3  37.57,23.34 180 top
PMOS4  37.57,30.96 180 top
PMOS5  37.57,38.58 180 top
PMOS6  37.57,46.2 180 top
PMOS7  37.57,53.82 180 top
PMOS8  37.57,61.44 180 top
PMOS9  37.57,69.06 180 top
PMOS10  37.57,76.68 180 top
PMOS11  37.57,84.3 180 top
PMOS12  37.57,92.56 180 top
R_A1  90.07,42.6 0 top
R_A2  90.07,46.1 0 top
R_A3  90.07,50.11 0 top
R_A4  90.07,53.82 0 top
R_B1.  95,25.3 0 top
R_B2.  94.95,28.52 0 top
R_B3.  95,31.75 0 top
R_B4.  95,34.98 0 top
R_C0  50.04,-52.2 0 top  (outside the outline)
R_CIN0  54.71,3.66 180 bottom
R_CIN1  44.55,10.64 0 top
R_CIN2  44.55,18.26 0 top
R_CIN3  44.55,25.88 0 top
R_CIN4  44.55,33.5 0 top
R_CIN5  44.55,41.12 0 top
R_CIN6  44.55,48.74 0 top
R_CIN7  44.55,56.36 0 top
R_CIN8  44.55,63.98 0 top
R_CIN9  44.55,71.6 0 top
R_CIN10  44.55,79.22 0 top
R_CIN11  44.55,86.84 0 top
R_CIN12  44.55,95.1 0 top
R_GPIO1  112.06,32.49 0 top  (outside the outline)
R_GPIO2  117.58,20.22 270 top  (outside the outline)
R_SGATE1  43.92,6.83 0 top
R_SGATE2  43.92,14.45 0 top
R_SGATE3  43.92,22.07 0 top
R_SGATE4  43.92,29.69 0 top
R_SGATE5  43.92,37.31 0 top
R_SGATE6  43.92,44.93 0 top
R_SGATE7  43.92,52.55 0 top
R_SGATE8  43.92,60.17 0 top
R_SGATE9  43.92,67.79 0 top
R_SGATE10  43.92,75.41 0 top
R_SGATE11  43.92,83.03 0 top
R_SGATE12  43.92,91.29 0 top
R_V+  134.26,25.12 0 top  (outside the outline)
R_VDD_VREG  88.52,-2.16 180 top
R_VDDHOST  118.44,60.38 0 top  (outside the outline)
R_VDDHV  104.11,12.34 0 top  (outside the outline)
R_VTEMP1  56.08,-8.05 0 top  (outside the outline)
R_VTEMP2  59.97,-7.01 270 top  (outside the outline)
R_WDTB  80.01,-29.74 180 top  (outside the outline)
RD1  26.77,7.47 0 top
RD2  26.77,15.09 0 top
RD3  26.77,22.71 0 top
RD4  26.77,30.33 0 top
RD5  26.77,37.95 0 top
RD6  26.77,45.57 0 top
RD7  26.77,53.19 0 top
RD8  26.77,60.81 0 top
RD9  26.77,68.43 0 top
RD10  26.77,76.05 0 top
RD11  26.77,83.67 0 top
RD12  26.77,91.92 0 top
RLED1  18.52,9.37 90 top
RLED2  18.52,16.99 90 top
RLED3  18.52,24.61 90 top
RLED4  18.52,32.23 90 top
RLED5  18.52,39.85 90 top
RLED6  18.52,47.47 90 top
RLED7  18.52,55.09 90 top
RLED8  18.52,62.71 90 top
RLED9  18.52,70.33 90 top
RLED10  18.52,77.95 90 top
RLED11  18.52,85.57 90 top
RLED12  18.52,93.83 90 top
SCHOTTKY_V+  74.68,92.33 270 bottom
SPI  108.05,51.28 90 top  (outside the outline)
U1  84.99,29.92 270 top
U2  71.4,13 270 top
V+_LTC  64.54,94.61 0 top
X1  7.21,70.97 270 top
X2  7.21,23.34 270 top
ZEN1  55.98,9.37 90 bottom
ZEN2  55.98,16.99 90 bottom
ZEN3  55.98,24.61 90 bottom
ZEN4  55.98,32.23 90 bottom
ZEN5  55.98,39.85 90 bottom
ZEN6  55.98,47.47 90 bottom
ZEN7  55.98,55.09 90 bottom
ZEN8  55.98,62.71 90 bottom
ZEN9  55.98,70.33 90 bottom
ZEN10  55.98,77.95 90 bottom
ZEN11  55.98,85.57 90 bottom
ZEN12  55.98,93.83 90 bottom

### Tracks (layer width: path | path; a pad name or v marks a point on that pad's centre or on a via)
0V  (via drill 0.35)  (12 unrouted)
  Top 0.305: U2.27 68.15,8.31 61.37,1.52 59.84,1.52 | U2.37 U2.38 | U2.38 U2.39 U2.40 | U2.28 U2.27 | 74.78,7.42 73.56,8.64 73.56,9.49 U2.38 | U2.27 68.15,10.85 69.8,12.5 v71.02,12.5 | U2.33 71.15,12.37 v71.02,12.5 | U2.38 73.65,11.09 | 73.65,11.09 72.24,12.5 v71.02,12.5 | U1.9 80.54,17.98 73.65,11.09
  Top 1.016: v47.09,1.63 59.74,1.63 59.84,1.52
  Bottom 1.016: C_CIN12.2 50.9,91.92 47.09,88.11 47.09,84.3 | C_CIN11.2 47.22,84.17 47.09,84.3 | C_CIN10.2 47.22,76.55 47.09,76.68 | 47.09,76.68 47.09,84.3 | C_CIN9.2 47.22,68.93 47.09,69.06 | 47.09,69.06 47.09,76.68 | C_CIN8.2 47.22,61.31 47.09,61.44 | 47.09,61.44 47.09,69.06 | C_CIN7.2 47.22,53.69 47.09,53.82 | 47.09,53.82 47.09,61.44 | C_CIN6.2 50.77,46.2 47.09,46.2 | 47.09,46.2 47.09,53.82 | C_CIN5.2 47.22,38.45 47.09,38.58 | 47.09,38.58 47.09,46.2 | C_CIN4.2 47.22,30.83 47.09,30.96 | 47.09,30.96 47.09,38.58 | C_CIN3.2 47.22,23.21 47.09,23.34 | 47.09,23.34 47.09,30.96 | C_CIN2.2 47.22,15.59 47.09,15.72 | 47.09,15.72 47.09,23.34 | C_CIN1.2 47.22,7.97 47.09,8.1 | 47.09,8.1 47.09,15.72 | 47.09,8.1 v47.09,1.63 | v47.09,1.63 45.06,3.66 F13.1 | ISOLATED_DCDC.1 85.46,95.38 | 85.05,95.8 ISOLATED_DCDC.1 | 75.44,89.98 SCHOTTKY_V+.A 71.11,89.98 C_V+LTC.2 | 75.44,89.98 80.31,89.98 85.05,94.72 | 85.05,94.72 ISOLATED_DCDC.1 | D2_V+.A 72.76,79.62 D1_V+.A 75.44,81.41 75.44,89.98 | 85.05,94.72 86.29,95.96 NTC2.1 93.27,96.01 95,96.01 97.52,93.49 97.52,88.39 95.18,86.05 NTC1.1 | v47.09,1.63 58.62,1.63 69.49,12.5 v71.02,12.5
5V_HOST  (4 unrouted)
C0
  Bottom 1.016: ZEN1.A 55.98,3.81 R_CIN0.2
C1  (via drill 0.35)
  Top 0.305: U2.24 66.65,8.13 65.63,7.11 62.05,7.11 58.52,10.64
  Top 1.016: R_CIN1.2 v53.44,10.64 58.52,10.64
  Bottom 1.016: ZEN2.A ZEN1.C 55.98,10.64 v53.44,10.64 51.03,10.64 C_CIN1.1
C2  (via drill 0.35)
  Top 0.305: U2.22 64.32,18.26 v53.44,18.26
  Top 1.016: R_CIN2.2 v53.44,18.26
  Bottom 1.016: ZEN3.A ZEN2.C 55.73,18.26 v53.44,18.26 51.03,18.26 C_CIN2.1
C3  (via drill 0.35)
  Top 0.305: U2.20 67.15,18.7 59.97,25.88 57.71,25.88
  Top 1.016: R_CIN3.2 v53.44,25.88 57.71,25.88 58.52,25.88
  Bottom 1.016: ZEN4.A ZEN3.C 55.73,25.88 v53.44,25.88 51.03,25.88 C_CIN3.1
C4  (via drill 0.35)
  Top 0.305: U2.18 68.15,20.75 59.84,29.06 59.84,30.89 58.62,32.11 58.62,33.63 58.14,33.63 58.01,33.5
  Top 1.016: R_CIN4.2 v53.44,33.5 58.01,33.5 58.52,33.5
  Bottom 1.016: ZEN5.A ZEN4.C 55.98,33.5 v53.44,33.5 51.03,33.5 C_CIN4.1
C5  (via drill 0.35)
  Top 0.305: U2.16 69.15,22.8 61.67,30.28 61.67,36.37 58.45,39.6 58.45,41.12
  Top 1.016: R_CIN5.2 v53.44,41.12 58.45,41.12
  Bottom 1.016: ZEN6.A ZEN5.C 55.73,41.12 v53.44,41.12 51.03,41.12 C_CIN5.1
C6  (via drill 0.35)
  Top 0.305: U2.14 70.15,24.85 63.5,31.5 63.5,42.47 58.52,47.45 58.52,48.74
  Top 1.016: R_CIN6.2 v53.44,48.74 58.52,48.74
  Bottom 1.016: C_CIN6.1 51.03,48.74 v53.44,48.74 55.73,48.74 ZEN6.C ZEN7.A
C7  (via drill 0.35)
  Top 0.305: U2.12 71.15,26.89 65.33,32.72 65.33,47.95 58.52,54.76 58.52,56.36
  Top 1.016: R_CIN7.2 v53.44,56.36 58.52,56.36
  Bottom 1.016: ZEN8.A ZEN7.C 55.73,56.36 v53.44,56.36 51.03,56.36 C_CIN7.1
C8  (via drill 0.35)
  Top 0.305: U2.10 72.15,28.94 67.16,33.93 67.16,54.05 58.52,62.69 58.52,63.98
  Top 1.016: R_CIN8.2 v53.44,63.98 58.52,63.98
  Bottom 1.016: C_CIN8.1 51.03,63.98 v53.44,63.98 55.73,63.98 ZEN8.C ZEN9.A
C9  (via drill 0.35)
  Top 0.305: U2.8 73.15,31.3 68.99,35.46 68.99,59.84 58.52,70.31 58.52,71.6
  Top 1.016: R_CIN9.2 v53.44,71.6 58.52,71.6
  Bottom 1.016: ZEN10.A ZEN9.C 55.73,71.6 v53.44,71.6 51.03,71.6 C_CIN9.1
C10  (via drill 0.35)
  Top 0.305: U2.6 74.15,33.34 70.81,36.68 70.81,65.33 58.52,77.62 58.52,79.22
  Top 1.016: R_CIN10.2 v53.44,79.22 58.52,79.22
  Bottom 1.016: C_CIN10.1 51.03,79.22 v53.44,79.22 55.73,79.22 ZEN10.C ZEN11.A
C11  (via drill 0.35)
  Top 0.305: U2.4 75.15,35.39 72.64,37.9 72.64,71.42 57.23,86.84 56.67,86.84
  Top 1.016: R_CIN11.2 v53.44,86.84 56.67,86.84 57.91,85.6
  Bottom 1.016: 50.77,86.84 C_CIN11.1 51.03,86.84 v53.44,86.84 55.73,86.84 ZEN11.C | ZEN11.C 55.86,86.97 | ZEN11.C 56.24,86.84 | ZEN12.A ZEN11.C
C12  (via drill 0.35)
  Top 0.305: U2.2 76.15,37.44 74.47,39.12 74.47,79.35 58.73,95.1 v53.44,95.1
  Top 1.016: 46.1,95.23 R_CIN12.2 v53.44,95.1
  Bottom 1.016: C_CIN12.1 51.03,95.1 v53.44,95.1 55.73,95.1 ZEN12.C
CELL1+
  Bottom 1.016: F1.1 17.55,9.37 8.64,18.29 6.6,18.29 X2.5
CELL1-
  Bottom 1.016: F0.1 16.61,6.2 15.21,4.8 F13.2 10.77,8.1 X2.7
CELL2+
  Bottom 1.016: F2.1 14.71,16.99 8.36,23.34 X2.4
CELL3+
  Bottom 1.016: F3.1 13.74,24.61 9.93,28.42 X2.3
CELL4+
  Bottom 1.016: F4.1 14.07,32.23 12.8,33.5 X2.2
CELL5+
  Bottom 1.016: X2.1 7.85,39.85 F5.1
CELL6+
  Bottom 1.016: F6.1 14.07,47.47 6.58,54.97 X1.7
CELL7+
  Bottom 1.016: F7.1 14.71,55.09 8.99,60.81 X1.6
CELL8+
  Bottom 1.016: F8.1 15.34,62.71 12.17,65.89 X1.5
CELL9+
  Bottom 1.016: F9.1 15.34,70.33 14.71,70.97 X1.4
CELL10+
  Bottom 1.016: F10.1 14.71,77.95 12.8,76.05 X1.3
CELL11+
  Bottom 1.016: F11.1 14.71,85.57 10.26,81.13 X1.2
CELL12+
  Bottom 1.016: 17.78,93.98 22.28,98.48 59.94,98.48 62,96.42 V+_LTC.1
  Bottom 1.524: X1.1 10.01,86.21 17.78,93.98 18.87,93.98 F12.1
GND_HOST  (4 unrouted)
N$1  (1 unrouted)
N$2
  Top 1.016: PMOS1.1 40.23,9.1 R_SGATE1.1
N$3
  Top 1.016: LED1.A 29.09,7.47 RD1.2 30.04,7 PMOS1.3
N$4  (1 unrouted)
N$5  (1 unrouted)
N$6
  Top 1.016: RLED1.2 19,11.28 LED1.C
N$7  (via drill 0.35)  (1 unrouted)
  Top 1.016: RLED1.1 23.49,7.95 RD1.1 23.97,6.46 26.77,3.66 v50.9,3.66 58.52,3.66
  Bottom 1.016: R_CIN0.1 v50.9,3.66
N$8  (1 unrouted)
N$9
  Bottom 1.016: V+_LTC.3 67.08,95.78 69.6,98.3 76.72,98.3 ISOLATED_DCDC.2
N$10  (1 unrouted)
N$12
  Top 1.016: PMOS2.1 40.23,16.72 R_SGATE2.1
N$15  (2 unrouted)
  Top 0.305: 83.13,25.27 U1.11
  Top 0.61: U1.11 83.08,27.3 87.17,31.39 90.22,31.39 93.57,34.75 R_B4..1
N$16
  Top 1.016: LED2.A 29.09,15.09 | 29.09,15.09 RD2.2 | PMOS2.3 29.56,14.62 29.09,15.09
N$17
  Top 1.016: RLED2.2 19,18.9 LED2.C
N$18  (via drill 0.35)
  Top 1.016: v36.3,11.28 36.3,9.42 PMOS1.2 | v36.3,11.28 42.49,11.28 R_CIN1.1 | RLED2.1 23.49,15.57 RD2.1 24.87,15.09 28.68,11.28 v36.3,11.28
  Bottom 1.016: F1.2 34.39,9.37 v36.3,11.28
N$19  (1 unrouted)
  Top 0.61: U1.12 84.35,27.05 87.48,30.18 92.66,30.18 93.57,31.09 R_B3..1
N$20  (1 unrouted)
  Top 0.61: U1.13 85.62,26.8 87.78,28.96 93.88,28.96 93.88,28.88 R_B2..1
N$21
  Top 1.016: PMOS3.1 40.23,24.34 R_SGATE3.1
N$22  (1 unrouted)
  Top 0.61: U1.14 86.89,26.54 88.09,27.74 90.53,27.74 92.96,25.3 R_B1..1
N$23  (1 unrouted)
N$24  (1 unrouted)
N$25
  Top 1.016: LED3.A 29.09,22.71 RD3.2 29.25,23.02 28.99,23.02 29.95,22.07 30.12,22.24 PMOS3.3
N$26
  Top 1.016: RLED3.2 19,26.52 LED3.C
N$27  (via drill 0.35)
  Top 1.016: PMOS2.2 36.3,17.04 v36.3,18.9 | v36.3,18.9 42.49,18.9 R_CIN2.1 | v36.3,18.9 28.68,18.9 24.87,22.71 RD3.1 23.49,23.19 RLED3.1
  Bottom 1.016: v36.3,18.9 34.39,16.99 F2.2
N$28  (1 unrouted)
N$29  (2 unrouted)
N$30
  Top 1.016: PMOS4.1 40.23,31.96 R_SGATE4.1
N$31  (1 unrouted)
N$32  (1 unrouted)
N$33  (3 unrouted)
N$34
  Top 1.016: LED4.A 29.09,30.33 | 29.09,30.33 RD4.2 | PMOS4.3 29.56,29.86 29.09,30.33
N$35
  Top 1.016: RLED4.2 19,34.14 LED4.C
N$36  (via drill 0.35)
  Top 1.016: RLED4.1 23.49,30.81 | 23.49,30.81 RD4.1 | PMOS3.2 36.3,24.66 v36.3,26.52 | v36.3,26.52 42.49,26.52 R_CIN3.1 | v36.3,26.52 28.68,26.52 24.38,30.81 23.49,30.81
  Bottom 1.016: v36.3,26.52 34.39,24.61 F3.2
N$37  (3 unrouted)
N$38  (1 unrouted)
N$39
  Top 1.016: PMOS5.1 40.23,39.58 R_SGATE5.1
N$40  (1 unrouted)
N$43
  Top 1.016: LED5.A 29.09,37.95 | 29.09,37.95 RD5.2 | PMOS5.3 29.56,37.48 29.09,37.95
N$44
  Top 1.016: RLED5.2 19,41.76 LED5.C
N$45  (via drill 0.35)
  Top 1.016: RLED5.1 23.49,38.43 | 23.49,38.43 RD5.1 | PMOS4.2 36.3,32.28 v36.3,34.14 | v36.3,34.14 42.49,34.14 R_CIN4.1 | v36.3,34.14 28.68,34.14 24.38,38.43 23.49,38.43
  Bottom 1.016: v36.3,34.14 34.39,32.23 F4.2
N$48
  Top 1.016: PMOS6.1 40.23,47.2 R_SGATE6.1
N$52
  Top 1.016: LED6.A 29.09,45.57 RD6.2 30.04,45.1 PMOS6.3
N$53
  Top 1.016: RLED6.2 19,49.38 LED6.C
N$54  (via drill 0.35)
  Top 1.016: RLED6.1 23.49,46.05 | 23.49,46.05 RD6.1 | v36.3,41.76 36.3,39.9 PMOS5.2 | v36.3,41.76 42.49,41.76 R_CIN5.1 | v36.3,41.76 28.68,41.76 24.38,46.05 23.49,46.05
  Bottom 1.016: F5.2 34.39,39.85 v36.3,41.76
N$57
  Top 1.016: PMOS7.1 40.23,54.82 R_SGATE7.1
N$61
  Top 1.016: LED7.A 29.09,53.19 RD7.2 30.04,52.72 PMOS7.3
N$62
  Top 1.016: RLED7.2 19,57 LED7.C
N$63  (via drill 0.35)
  Top 1.016: RLED7.1 23.49,53.67 | 23.49,53.67 RD7.1 | v36.3,49.38 36.3,47.52 PMOS6.2 | v36.3,49.38 42.49,49.38 R_CIN6.1 | v36.3,49.38 28.68,49.38 24.38,53.67 23.49,53.67
  Bottom 1.016: F6.2 34.39,47.47 v36.3,49.38
N$66
  Top 1.016: PMOS8.1 40.23,62.44 R_SGATE8.1
N$70
  Top 1.016: LED8.A 29.73,60.17 29.95,60.17 29.95,60.43 | 29.95,60.43 RD8.2 | PMOS8.3 30.04,60.34 29.95,60.43
N$71
  Top 1.016: RLED8.2 19,64.62 LED8.C
N$72  (via drill 0.35)
  Top 1.016: RLED8.1 23.49,61.29 RD8.1 24.87,60.81 28.68,57 v36.3,57 | v36.3,57 36.3,55.14 PMOS7.2 | v36.3,57 42.49,57 R_CIN7.1
  Bottom 1.016: F7.2 34.39,55.09 v36.3,57
N$75
  Top 1.016: PMOS9.1 40.23,70.06 R_SGATE9.1
N$79
  Top 1.016: PMOS9.3 29.48,67.96 | 29.48,67.96 29.31,67.79 29.31,68.17 RD9.2 | LED9.A 29.48,68.04 29.48,67.96
N$80
  Top 1.016: RLED9.2 19,72.24 LED9.C
N$81  (via drill 0.35)
  Top 1.016: RLED9.1 23.49,68.91 | 23.49,68.91 RD9.1 | PMOS8.2 36.3,62.76 v36.3,64.62 | v36.3,64.62 42.49,64.62 R_CIN8.1 | v36.3,64.62 28.68,64.62 24.38,68.91 23.49,68.91
  Bottom 1.016: v36.3,64.62 34.39,62.71 F8.2
N$84
  Top 1.016: PMOS10.1 40.23,77.68 R_SGATE10.1
N$88
  Top 1.016: PMOS10.3 30.04,75.58 | 30.04,75.58 RD10.2 | LED10.A 29.56,75.58 30.04,75.58
N$89
  Top 1.016: RLED10.2 19,79.86 LED10.C
N$90  (via drill 0.35)
  Top 1.016: RLED10.1 23.49,76.53 RD10.1 24.87,76.05 28.68,72.24 v36.3,72.24 | PMOS9.2 36.3,70.38 v36.3,72.24 | v36.3,72.24 42.49,72.24 R_CIN9.1
  Bottom 1.016: v36.3,72.24 34.39,70.33 F9.2
N$93
  Top 1.016: PMOS11.1 40.23,85.3 R_SGATE11.1
N$97
  Top 1.016: PMOS11.3 29.57,83.2 | LED11.A 29.56,83.2 29.57,83.2 | RD11.2 29.57,83.2
N$98
  Top 1.016: RLED11.2 19,87.48 LED11.C
N$99  (via drill 0.35)
  Top 1.016: R_CIN10.1 42.49,79.86 v36.3,79.86 | PMOS10.2 36.3,78 v36.3,79.86 | RLED11.1 23.49,84.15 | 23.49,84.15 RD11.1 | v36.3,79.86 28.68,79.86 24.38,84.15 23.49,84.15
  Bottom 1.016: v36.3,79.86 34.39,77.95 F10.2
N$102
  Top 1.016: PMOS12.1 40.23,93.56 R_SGATE12.1
N$105  (via drill 0.35)
  Top 1.016: PMOS12.2 36.62,95.29 v36.3,95.61 42.62,95.61 R_CIN12.1
  Bottom 1.016: v36.3,95.61 34.52,93.83 F12.2
N$106
  Top 1.016: LED12.A 29.73,91.29 | 29.73,91.29 29.95,91.29 29.95,91.55 RD12.2 | PMOS12.3 29.9,91.46 29.73,91.29
N$107
  Top 1.016: RLED12.2 19,95.73 LED12.C
N$108  (via drill 0.35)  (1 unrouted)
  Top 1.016: v36.3,87.48 36.3,85.57 | PMOS11.2 36.57,85.3 | v36.3,87.48 42.49,87.48 R_CIN11.1 | 24.23,91.92 RD12.1 23.49,92.41 | 18.67,92.56 RLED12.1 23.49,92.41 | v36.3,87.48 29.31,87.48 24.38,92.41 23.49,92.41
  Bottom 1.016: v36.3,87.48 34.39,85.57 F11.2
S1
  Top 0.305: U2.25 67.15,7.71 65.33,5.89 59.46,5.89 58.52,6.83
  Top 1.016: 58.52,6.83 R_SGATE1.2
S2
  Top 0.305: U2.23 66.15,11.47 63.17,14.45 58.52,14.45
  Top 1.016: 58.52,14.45 R_SGATE2.2
S3
  Top 0.305: U2.21 66.65,17.98 62.28,22.35 58.8,22.35 58.52,22.07
  Top 1.016: 58.52,22.07 R_SGATE3.2
S4
  Top 0.305: U2.19 67.65,19.73 58.62,28.75 58.62,29.69 58.52,29.69
  Top 1.016: 58.52,29.69 R_SGATE4.2
S5
  Top 0.305: U2.17 68.65,21.77 60.76,29.67 60.76,33.33 58.62,35.46 58.62,37.31 | 58.9,37.31 58.62,37.31 | 58.62,37.31 58.52,37.31
  Top 1.016: 58.52,37.31 R_SGATE5.2
S6
  Top 0.305: U2.15 69.65,23.82 62.59,30.89 62.59,38.81 58.52,42.88 58.52,44.93
  Top 1.016: 58.52,44.93 R_SGATE6.2
S7
  Top 0.305: U2.13 70.65,25.87 64.41,32.11 64.41,45.21 58.52,51.1 58.52,52.55
  Top 1.016: 58.52,52.55 R_SGATE7.2
S8
  Top 0.305: U2.11 71.65,27.92 66.24,33.33 66.24,51 58.52,58.73 58.52,60.17
  Top 1.016: 58.52,60.17 R_SGATE8.2
S9
  Top 0.305: U2.9 72.65,29.97 68.07,34.54 68.07,56.79 58.52,66.34 58.52,67.79
  Top 1.016: 58.52,67.79 R_SGATE9.2
S10
  Top 0.305: U2.7 73.65,32.32 69.9,36.07 69.9,62.59 58.52,73.97 58.52,75.41
  Top 1.016: 58.52,75.41 R_SGATE10.2
S11
  Top 0.305: 74.69,16.47 U2.5 74.65,34.37 71.73,37.29 71.73,68.38 58.52,81.58 58.52,83.03
  Top 1.016: 58.52,83.03 R_SGATE11.2
S12
  Top 0.305: U2.3 75.65,36.41 73.56,38.51 73.56,77.78 60.05,91.29 R_SGATE12.2
SPI_CHIPSELECT  (1 unrouted)
SPI_CLOCK  (1 unrouted)
SPI_MASTERIN  (1 unrouted)
SPI_MASTEROUT  (1 unrouted)
V+_LTC  (1 unrouted)
  Bottom 1.016: 64.31,94.38 V+_LTC.2 64.54,92.05 D1_V+.C | D1_V+.C 68.02,91.95 70.28,91.95 C_V+LTC.1 73.01,94.68 SCHOTTKY_V+.C | D2_V+.C 61.86,90.26 D1_V+.C
VREF  (3 unrouted)
VREG  (8 unrouted)
  Top 0.305: U2.32 70.65,7.89 72.03,6.5
  Top 0.61: U1.16 91.19,23.47 95.1,23.47 96.42,24.79 | 96.42,24.79 R_B1..2 | 96.42,24.79 96.37,24.84 R_B2..2 96.42,28.57 R_B3..2 R_B4..2 96.42,35.56 94.79,37.19 92.66,37.19 91.14,35.66 91.14,33.83 89.92,32.61 86.87,32.61 81.81,27.56 U1.10
(copper drawn outside any net)
  shapes: Top area x2